# Altium schematic sheet SysUprTestUULed.SchDoc
size 594 x 420 mm; MainDevice: Плата индикации; Name: Плата индикации; PageSetup: Record=PageOptions|CenterHorizontal=True|CenterVertical=True|PrintScale=0.94|XCorrection=1.00|YCorrection=1.00|PrintKind=1|BorderSize=5000000|LeftOffset=0|BottomOffset=0|Orientation=1|PaperLength=1000|PaperWidth=1000|Scale=100|PaperSource=7|PrintQuality=-4|MediaType=1|DitherType=10|PaperKind=A4|PrintScaleMode=1; ApprovedBy: Кайбалдиев; CheckedBy: Савельев; DrawnBy: Соловьев; Engineer: Т.контр.; DocumentNumber: Э-917.03Э3; SheetNumber: 3; SheetTotal: 4; Title1str: Плата индикации; DocumentType1str: Схема электрическая; DocumentType2str: принципиальная; ImagePath: Э-917.03
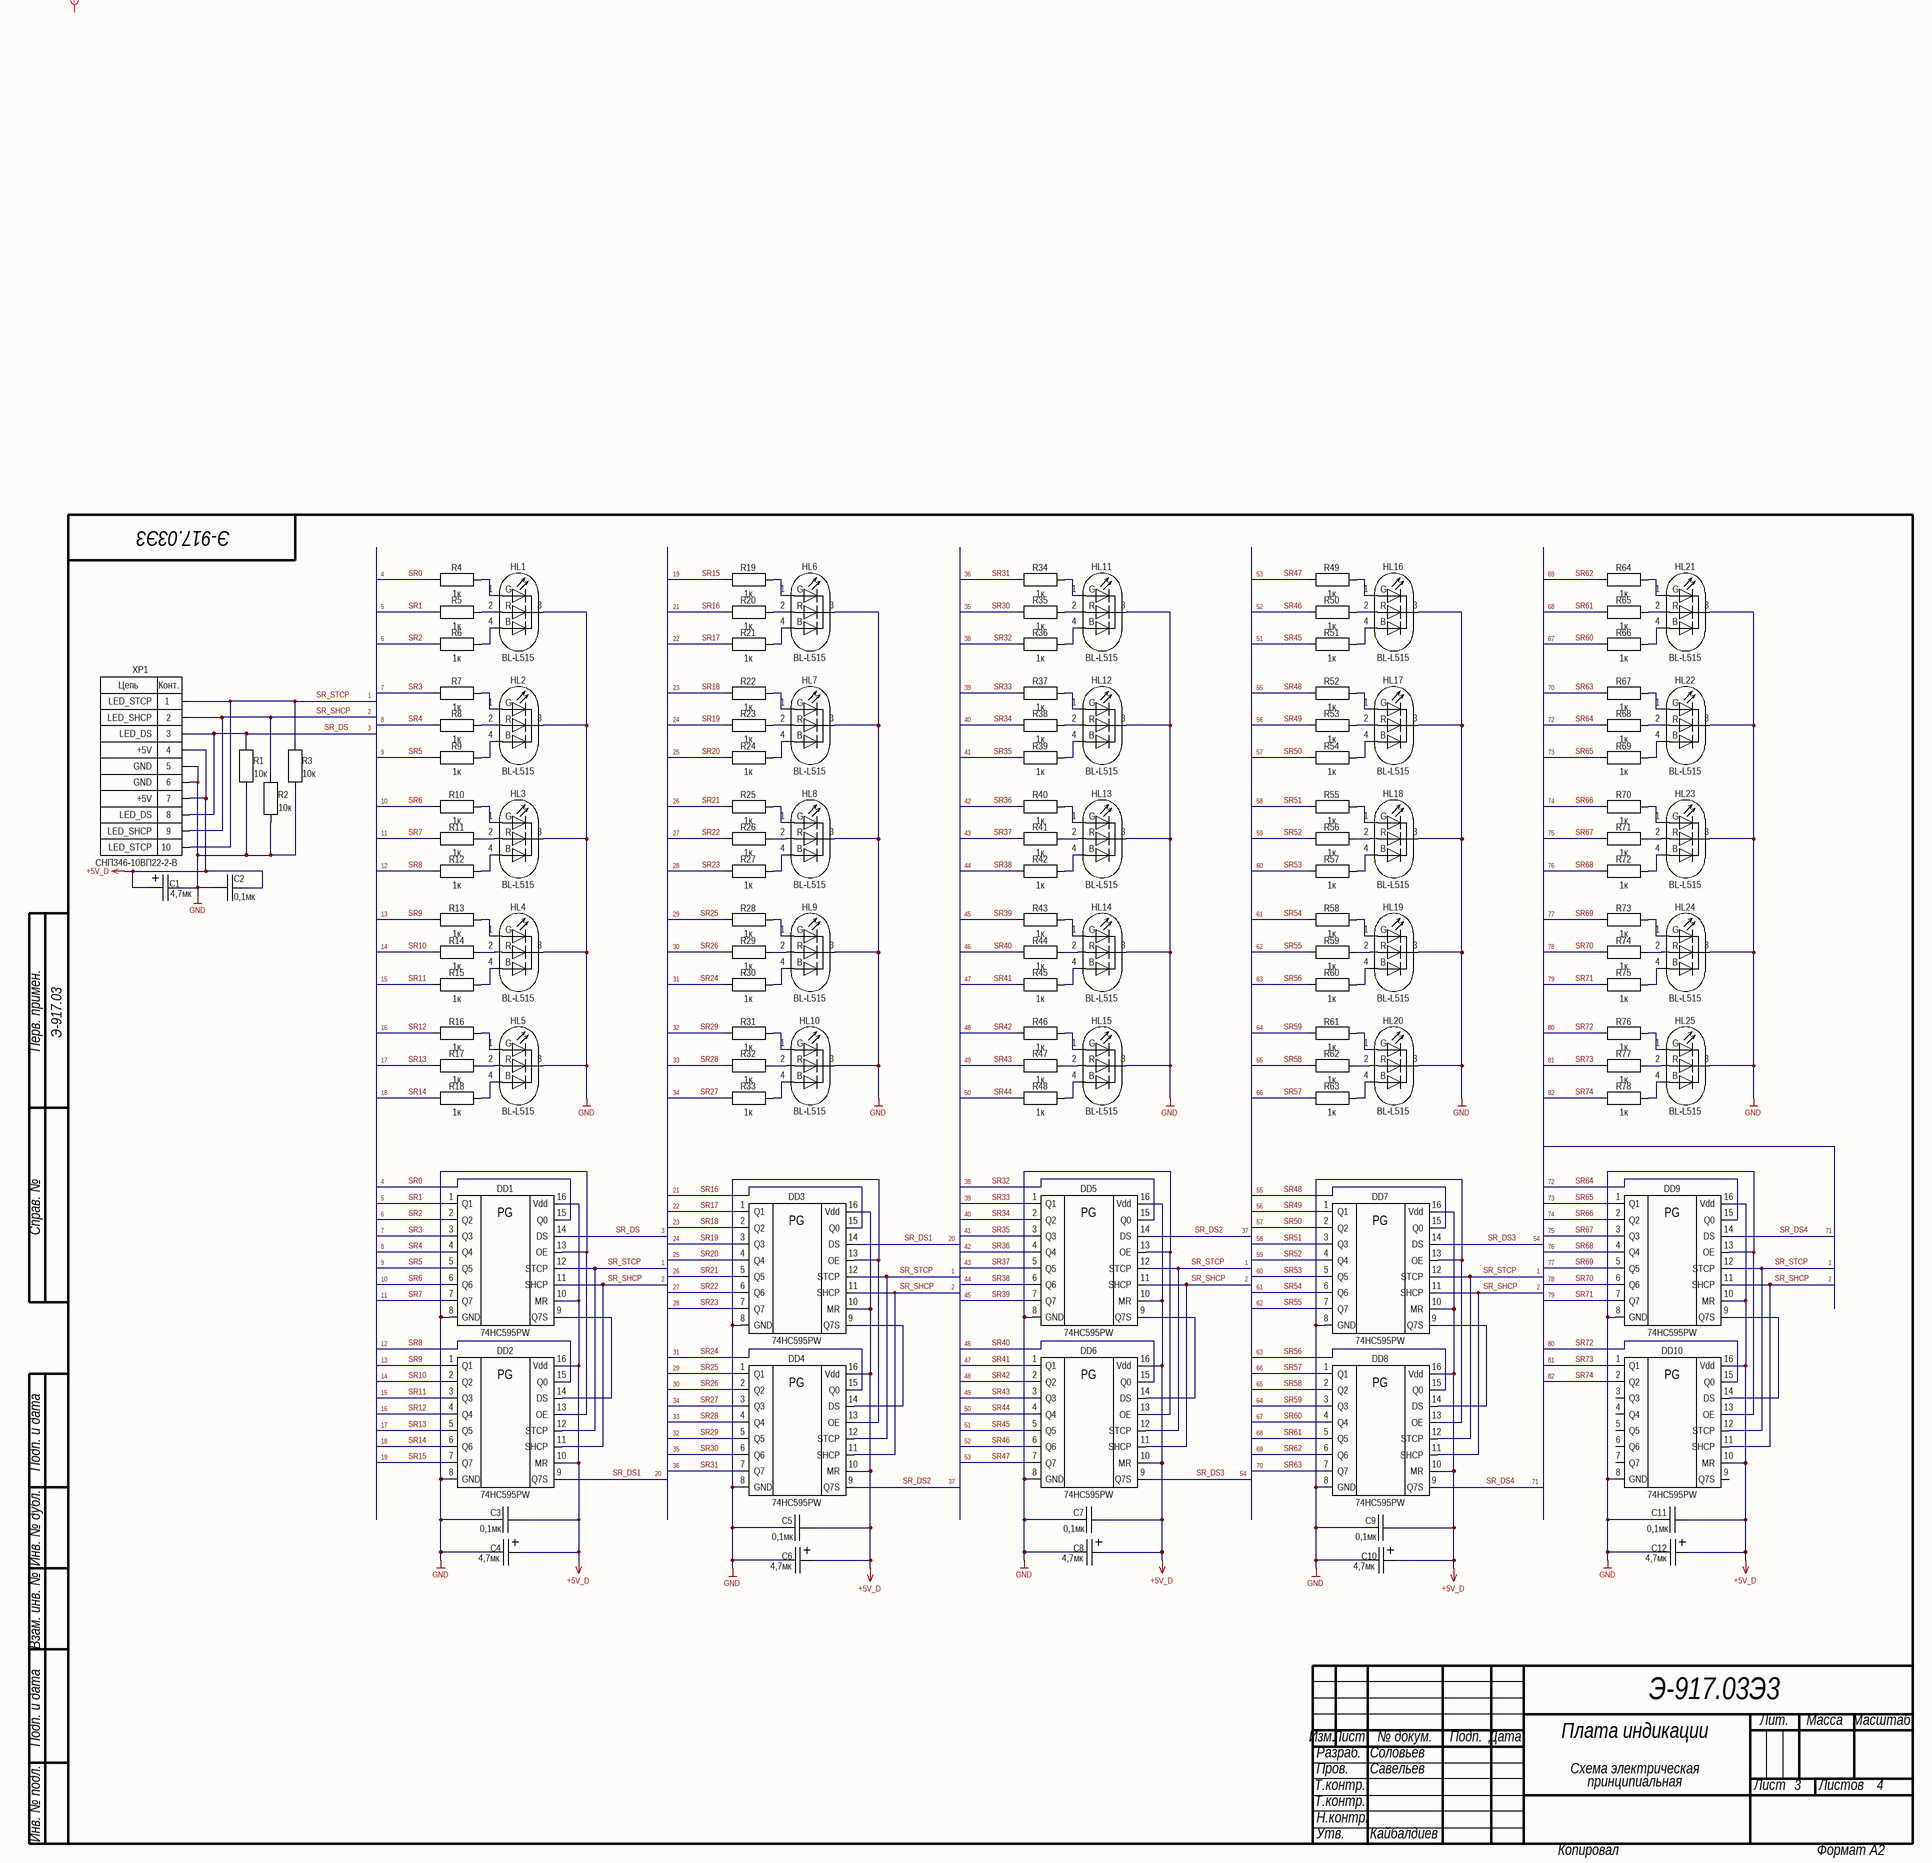
[diagram p0: SysUprTestUULed.SchDoc]

## Parts
C1  value 4,7мк  [CapCaseB]  (hidden comment: PolCap)
C2  value 0,1мк  [Cap0805]  (hidden comment: Capacitor)
C3  value 0,1мк  [Cap0805]  (hidden comment: Capacitor)
C4  value 4,7мк  [CapCaseB]  (hidden comment: PolCap)
C5  value 0,1мк  [Cap0805]  (hidden comment: Capacitor)
C6  value 4,7мк  [CapCaseB]  (hidden comment: PolCap)
C7  value 0,1мк  [Cap0805]  (hidden comment: Capacitor)
C8  value 4,7мк  [CapCaseB]  (hidden comment: PolCap)
C9  value 0,1мк  [Cap0805]  (hidden comment: Capacitor)
C10  value 4,7мк  [CapCaseB]  (hidden comment: PolCap)
C11  value 0,1мк  [Cap0805]  (hidden comment: Capacitor)
C12  value 4,7мк  [CapCaseB]  (hidden comment: PolCap)
DD1  74HC595  [TSSOP16]  (value not drawn)
DD2  74HC595  [TSSOP16]  (value not drawn)
DD3  74HC595  [TSSOP16]  (value not drawn)
DD4  74HC595  [TSSOP16]  (value not drawn)
DD5  74HC595  [TSSOP16]  (value not drawn)
DD6  74HC595  [TSSOP16]  (value not drawn)
DD7  74HC595  [TSSOP16]  (value not drawn)
DD8  74HC595  [TSSOP16]  (value not drawn)
DD9  74HC595  [TSSOP16]  (value not drawn)
DD10  74HC595  [TSSOP16]  (value not drawn)
HL1  LED-RGB_C  [BL-L515]  (value not drawn)
HL2  LED-RGB_C  [BL-L515]  (value not drawn)
HL3  LED-RGB_C  [BL-L515]  (value not drawn)
HL4  LED-RGB_C  [BL-L515]  (value not drawn)
HL5  LED-RGB_C  [BL-L515]  (value not drawn)
HL6  LED-RGB_C  [BL-L515]  (value not drawn)
HL7  LED-RGB_C  [BL-L515]  (value not drawn)
HL8  LED-RGB_C  [BL-L515]  (value not drawn)
HL9  LED-RGB_C  [BL-L515]  (value not drawn)
HL10  LED-RGB_C  [BL-L515]  (value not drawn)
HL11  LED-RGB_C  [BL-L515]  (value not drawn)
HL12  LED-RGB_C  [BL-L515]  (value not drawn)
HL13  LED-RGB_C  [BL-L515]  (value not drawn)
HL14  LED-RGB_C  [BL-L515]  (value not drawn)
HL15  LED-RGB_C  [BL-L515]  (value not drawn)
HL16  LED-RGB_C  [BL-L515]  (value not drawn)
HL17  LED-RGB_C  [BL-L515]  (value not drawn)
HL18  LED-RGB_C  [BL-L515]  (value not drawn)
HL19  LED-RGB_C  [BL-L515]  (value not drawn)
HL20  LED-RGB_C  [BL-L515]  (value not drawn)
HL21  LED-RGB_C  [BL-L515]  (value not drawn)
HL22  LED-RGB_C  [BL-L515]  (value not drawn)
HL23  LED-RGB_C  [BL-L515]  (value not drawn)
HL24  LED-RGB_C  [BL-L515]  (value not drawn)
HL25  LED-RGB_C  [BL-L515]  (value not drawn)
R1  value 10к  [Res0402]  (hidden comment: Resistor0062)
R2  value 10к  [Res0402]  (hidden comment: Resistor0062)
R3  value 10к  [Res0402]  (hidden comment: Resistor0062)
R4  value 1к  [Res0805]  (hidden comment: Resistor0125)
R5  value 1к  [Res0805]  (hidden comment: Resistor0125)
R6  value 1к  [Res0805]  (hidden comment: Resistor0125)
R7  value 1к  [Res0805]  (hidden comment: Resistor0125)
R8  value 1к  [Res0805]  (hidden comment: Resistor0125)
R9  value 1к  [Res0805]  (hidden comment: Resistor0125)
R10  value 1к  [Res0805]  (hidden comment: Resistor0125)
R11  value 1к  [Res0805]  (hidden comment: Resistor0125)
R12  value 1к  [Res0805]  (hidden comment: Resistor0125)
R13  value 1к  [Res0805]  (hidden comment: Resistor0125)
R14  value 1к  [Res0805]  (hidden comment: Resistor0125)
R15  value 1к  [Res0805]  (hidden comment: Resistor0125)
R16  value 1к  [Res0805]  (hidden comment: Resistor0125)
R17  value 1к  [Res0805]  (hidden comment: Resistor0125)
R18  value 1к  [Res0805]  (hidden comment: Resistor0125)
R19  value 1к  [Res0805]  (hidden comment: Resistor0125)
R20  value 1к  [Res0805]  (hidden comment: Resistor0125)
R21  value 1к  [Res0805]  (hidden comment: Resistor0125)
R22  value 1к  [Res0805]  (hidden comment: Resistor0125)
R23  value 1к  [Res0805]  (hidden comment: Resistor0125)
R24  value 1к  [Res0805]  (hidden comment: Resistor0125)
R25  value 1к  [Res0805]  (hidden comment: Resistor0125)
R26  value 1к  [Res0805]  (hidden comment: Resistor0125)
R27  value 1к  [Res0805]  (hidden comment: Resistor0125)
R28  value 1к  [Res0805]  (hidden comment: Resistor0125)
R29  value 1к  [Res0805]  (hidden comment: Resistor0125)
R30  value 1к  [Res0805]  (hidden comment: Resistor0125)
R31  value 1к  [Res0805]  (hidden comment: Resistor0125)
R32  value 1к  [Res0805]  (hidden comment: Resistor0125)
R33  value 1к  [Res0805]  (hidden comment: Resistor0125)
R34  value 1к  [Res0805]  (hidden comment: Resistor0125)
R35  value 1к  [Res0805]  (hidden comment: Resistor0125)
R36  value 1к  [Res0805]  (hidden comment: Resistor0125)
R37  value 1к  [Res0805]  (hidden comment: Resistor0125)
R38  value 1к  [Res0805]  (hidden comment: Resistor0125)
R39  value 1к  [Res0805]  (hidden comment: Resistor0125)
R40  value 1к  [Res0805]  (hidden comment: Resistor0125)
R41  value 1к  [Res0805]  (hidden comment: Resistor0125)
R42  value 1к  [Res0805]  (hidden comment: Resistor0125)
R43  value 1к  [Res0805]  (hidden comment: Resistor0125)
R44  value 1к  [Res0805]  (hidden comment: Resistor0125)
R45  value 1к  [Res0805]  (hidden comment: Resistor0125)
R46  value 1к  [Res0805]  (hidden comment: Resistor0125)
R47  value 1к  [Res0805]  (hidden comment: Resistor0125)
R48  value 1к  [Res0805]  (hidden comment: Resistor0125)
R49  value 1к  [Res0805]  (hidden comment: Resistor0125)
R50  value 1к  [Res0805]  (hidden comment: Resistor0125)
R51  value 1к  [Res0805]  (hidden comment: Resistor0125)
R52  value 1к  [Res0805]  (hidden comment: Resistor0125)
R53  value 1к  [Res0805]  (hidden comment: Resistor0125)
R54  value 1к  [Res0805]  (hidden comment: Resistor0125)
R55  value 1к  [Res0805]  (hidden comment: Resistor0125)
R56  value 1к  [Res0805]  (hidden comment: Resistor0125)
R57  value 1к  [Res0805]  (hidden comment: Resistor0125)
R58  value 1к  [Res0805]  (hidden comment: Resistor0125)
R59  value 1к  [Res0805]  (hidden comment: Resistor0125)
R60  value 1к  [Res0805]  (hidden comment: Resistor0125)
R61  value 1к  [Res0805]  (hidden comment: Resistor0125)
R62  value 1к  [Res0805]  (hidden comment: Resistor0125)
R63  value 1к  [Res0805]  (hidden comment: Resistor0125)
R64  value 1к  [Res0805]  (hidden comment: Resistor0125)
R65  value 1к  [Res0805]  (hidden comment: Resistor0125)
R66  value 1к  [Res0805]  (hidden comment: Resistor0125)
R67  value 1к  [Res0805]  (hidden comment: Resistor0125)
R68  value 1к  [Res0805]  (hidden comment: Resistor0125)
R69  value 1к  [Res0805]  (hidden comment: Resistor0125)
R70  value 1к  [Res0805]  (hidden comment: Resistor0125)
R71  value 1к  [Res0805]  (hidden comment: Resistor0125)
R72  value 1к  [Res0805]  (hidden comment: Resistor0125)
R73  value 1к  [Res0805]  (hidden comment: Resistor0125)
R74  value 1к  [Res0805]  (hidden comment: Resistor0125)
R75  value 1к  [Res0805]  (hidden comment: Resistor0125)
R76  value 1к  [Res0805]  (hidden comment: Resistor0125)
R77  value 1к  [Res0805]  (hidden comment: Resistor0125)
R78  value 1к  [Res0805]  (hidden comment: Resistor0125)
XP1  ConnectorP10  [PLD-10]  (value not drawn)

## Nets
+5V_D: C1.2 C2.1 C3.2 C4.2 C5.2 C6.2 C7.2 C8.2 C9.2 C10.2 C11.2 C12.2 DD1.10(MR) DD1.16(Vdd) DD2.10(MR) DD2.16(Vdd) DD3.10(MR) DD3.16(Vdd) DD4.10(MR) DD4.16(Vdd) DD5.10(MR) DD5.16(Vdd) DD6.10(MR) DD6.16(Vdd) DD7.10(MR) DD7.16(Vdd) DD8.10(MR) DD8.16(Vdd) DD9.10(MR) DD9.16(Vdd) DD10.10(MR) DD10.16(Vdd) XP1.4 XP1.7
GND: C1.1 C2.2 C3.1 C4.1 C5.1 C6.1 C7.1 C8.1 C9.1 C10.1 C11.1 C12.1 DD1.8(GND) DD1.13(OE) DD2.8(GND) DD2.13(OE) DD3.8(GND) DD3.13(OE) DD4.8(GND) DD4.13(OE) DD5.8(GND) DD5.13(OE) DD6.8(GND) DD6.13(OE) DD7.8(GND) DD7.13(OE) DD8.8(GND) DD8.13(OE) DD9.8(GND) DD9.13(OE) DD10.8(GND) DD10.13(OE) HL1.3(A) HL2.3(A) HL3.3(A) HL4.3(A) HL5.3(A) HL6.3(A) HL7.3(A) HL8.3(A) HL9.3(A) HL10.3(A) HL11.3(A) HL12.3(A) HL13.3(A) HL14.3(A) HL15.3(A) HL16.3(A) HL17.3(A) HL18.3(A) HL19.3(A) HL20.3(A) HL21.3(A) HL22.3(A) HL23.3(A) HL24.3(A) HL25.3(A) R1.1 R2.1 R3.1 XP1.5 XP1.6
SR0: DD1.15(Q0) R4.2
SR1: DD1.1(Q1) R5.2
SR2: DD1.2(Q2) R6.2
SR3: DD1.3(Q3) R7.2
SR4: DD1.4(Q4) R8.2
SR5: DD1.5(Q5) R9.2
SR6: DD1.6(Q6) R10.2
SR7: DD1.7(Q7) R11.2
SR8: DD2.15(Q0) R12.2
SR9: DD2.1(Q1) R13.2
SR10: DD2.2(Q2) R14.2
SR11: DD2.3(Q3) R15.2
SR12: DD2.4(Q4) R16.2
SR13: DD2.5(Q5) R17.2
SR14: DD2.6(Q6) R18.2
SR15: DD2.7(Q7) R19.2
SR16: DD3.15(Q0) R20.2
SR17: DD3.1(Q1) R21.2
SR18: DD3.2(Q2) R22.2
SR19: DD3.3(Q3) R23.2
SR20: DD3.4(Q4) R24.2
SR21: DD3.5(Q5) R25.2
SR22: DD3.6(Q6) R26.2
SR23: DD3.7(Q7) R27.2
SR24: DD4.15(Q0) R30.2
SR25: DD4.1(Q1) R28.2
SR26: DD4.2(Q2) R29.2
SR27: DD4.3(Q3) R33.2
SR28: DD4.4(Q4) R32.2
SR29: DD4.5(Q5) R31.2
SR30: DD4.6(Q6) R35.2
SR31: DD4.7(Q7) R34.2
SR32: DD5.15(Q0) R36.2
SR33: DD5.1(Q1) R37.2
SR34: DD5.2(Q2) R38.2
SR35: DD5.3(Q3) R39.2
SR36: DD5.4(Q4) R40.2
SR37: DD5.5(Q5) R41.2
SR38: DD5.6(Q6) R42.2
SR39: DD5.7(Q7) R43.2
SR40: DD6.15(Q0) R44.2
SR41: DD6.1(Q1) R45.2
SR42: DD6.2(Q2) R46.2
SR43: DD6.3(Q3) R47.2
SR44: DD6.4(Q4) R48.2
SR45: DD6.5(Q5) R51.2
SR46: DD6.6(Q6) R50.2
SR47: DD6.7(Q7) R49.2
SR48: DD7.15(Q0) R52.2
SR49: DD7.1(Q1) R53.2
SR50: DD7.2(Q2) R54.2
SR51: DD7.3(Q3) R55.2
SR52: DD7.4(Q4) R56.2
SR53: DD7.5(Q5) R57.2
SR54: DD7.6(Q6) R58.2
SR55: DD7.7(Q7) R59.2
SR56: DD8.15(Q0) R60.2
SR57: DD8.1(Q1) R63.2
SR58: DD8.2(Q2) R62.2
SR59: DD8.3(Q3) R61.2
SR60: DD8.4(Q4) R66.2
SR61: DD8.5(Q5) R65.2
SR62: DD8.6(Q6) R64.2
SR63: DD8.7(Q7) R67.2
SR64: DD9.15(Q0) R68.2
SR65: DD9.1(Q1) R69.2
SR66: DD9.2(Q2) R70.2
SR67: DD9.3(Q3) R71.2
SR68: DD9.4(Q4) R72.2
SR69: DD9.5(Q5) R73.2
SR70: DD9.6(Q6) R74.2
SR71: DD9.7(Q7) R75.2
SR72: DD10.15(Q0) R76.2
SR73: DD10.1(Q1) R77.2
SR74: DD10.2(Q2) R78.2
SR_DS: DD1.14(DS) R1.2 XP1.3 XP1.8
SR_DS1: DD2.9(Q7S) DD3.14(DS)
SR_DS2: DD4.9(Q7S) DD5.14(DS)
SR_DS3: DD6.9(Q7S) DD7.14(DS)
SR_DS4: DD8.9(Q7S) DD9.14(DS)
SR_SHCP: DD1.11(SHCP) DD2.11(SHCP) DD3.11(SHCP) DD4.11(SHCP) DD5.11(SHCP) DD6.11(SHCP) DD7.11(SHCP) DD8.11(SHCP) DD9.11(SHCP) DD10.11(SHCP) R2.2 XP1.2 XP1.9
SR_STCP: DD1.12(STCP) DD2.12(STCP) DD3.12(STCP) DD4.12(STCP) DD5.12(STCP) DD6.12(STCP) DD7.12(STCP) DD8.12(STCP) DD9.12(STCP) DD10.12(STCP) R3.2 XP1.1 XP1.10
NetDD1_9: DD1.9(Q7S) DD2.14(DS)
NetDD3_9: DD3.9(Q7S) DD4.14(DS)
NetDD5_9: DD5.9(Q7S) DD6.14(DS)
NetDD7_9: DD7.9(Q7S) DD8.14(DS)
NetDD9_9: DD9.9(Q7S) DD10.14(DS)
NetHL1_1: HL1.1(G) R4.1
NetHL1_2: HL1.2(B) R5.1
NetHL1_4: HL1.4(R) R6.1
NetHL2_1: HL2.1(G) R7.1
NetHL2_2: HL2.2(B) R8.1
NetHL2_4: HL2.4(R) R9.1
NetHL3_1: HL3.1(G) R10.1
NetHL3_2: HL3.2(B) R11.1
NetHL3_4: HL3.4(R) R12.1
NetHL4_1: HL4.1(G) R13.1
NetHL4_2: HL4.2(B) R14.1
NetHL4_4: HL4.4(R) R15.1
NetHL5_1: HL5.1(G) R16.1
NetHL5_2: HL5.2(B) R17.1
NetHL5_4: HL5.4(R) R18.1
NetHL6_1: HL6.1(G) R19.1
NetHL6_2: HL6.2(B) R20.1
NetHL6_4: HL6.4(R) R21.1
NetHL7_1: HL7.1(G) R22.1
NetHL7_2: HL7.2(B) R23.1
NetHL7_4: HL7.4(R) R24.1
NetHL8_1: HL8.1(G) R25.1
NetHL8_2: HL8.2(B) R26.1
NetHL8_4: HL8.4(R) R27.1
NetHL9_1: HL9.1(G) R28.1
NetHL9_2: HL9.2(B) R29.1
NetHL9_4: HL9.4(R) R30.1
NetHL10_1: HL10.1(G) R31.1
NetHL10_2: HL10.2(B) R32.1
NetHL10_4: HL10.4(R) R33.1
NetHL11_1: HL11.1(G) R34.1
NetHL11_2: HL11.2(B) R35.1
NetHL11_4: HL11.4(R) R36.1
NetHL12_1: HL12.1(G) R37.1
NetHL12_2: HL12.2(B) R38.1
NetHL12_4: HL12.4(R) R39.1
NetHL13_1: HL13.1(G) R40.1
NetHL13_2: HL13.2(B) R41.1
NetHL13_4: HL13.4(R) R42.1
NetHL14_1: HL14.1(G) R43.1
NetHL14_2: HL14.2(B) R44.1
NetHL14_4: HL14.4(R) R45.1
NetHL15_1: HL15.1(G) R46.1
NetHL15_2: HL15.2(B) R47.1
NetHL15_4: HL15.4(R) R48.1
NetHL16_1: HL16.1(G) R49.1
NetHL16_2: HL16.2(B) R50.1
NetHL16_4: HL16.4(R) R51.1
NetHL17_1: HL17.1(G) R52.1
NetHL17_2: HL17.2(B) R53.1
NetHL17_4: HL17.4(R) R54.1
NetHL18_1: HL18.1(G) R55.1
NetHL18_2: HL18.2(B) R56.1
NetHL18_4: HL18.4(R) R57.1
NetHL19_1: HL19.1(G) R58.1
NetHL19_2: HL19.2(B) R59.1
NetHL19_4: HL19.4(R) R60.1
NetHL20_1: HL20.1(G) R61.1
NetHL20_2: HL20.2(B) R62.1
NetHL20_4: HL20.4(R) R63.1
NetHL21_1: HL21.1(G) R64.1
NetHL21_2: HL21.2(B) R65.1
NetHL21_4: HL21.4(R) R66.1
NetHL22_1: HL22.1(G) R67.1
NetHL22_2: HL22.2(B) R68.1
NetHL22_4: HL22.4(R) R69.1
NetHL23_1: HL23.1(G) R70.1
NetHL23_2: HL23.2(B) R71.1
NetHL23_4: HL23.4(R) R72.1
NetHL24_1: HL24.1(G) R73.1
NetHL24_2: HL24.2(B) R74.1
NetHL24_4: HL24.4(R) R75.1
NetHL25_1: HL25.1(G) R76.1
NetHL25_2: HL25.2(B) R77.1
NetHL25_4: HL25.4(R) R78.1

Not connected (* = marked no-connect by the designer): DD10 3(Q3) 4(Q4) 5(Q5) 6(Q6) 7(Q7) 9(Q7S)

## Layout directives
mark named Info: (no net found under the mark)

## Notes on the sheet
- 4
- (near HL1) "ALM1"
- 19
- (near HL6) "ALM6"
- 36
- (near HL11) "ALM11"
- 53
- (near HL16) "ALM16"
- 69
- (near HL21) "ALM21"
- 5
- 6
- 21
- 22
- 35
- 38
- 51
- 52
- 67
- 68
- 1
- 2
- 7
- 8
- (near HL2) "ALM2"
- 23
- 24
- (near HL7) "ALM7"
- 39
- 40
- (near HL12) "ALM12"
- 55
- 56
- (near HL17) "ALM17"
- 70
- 72
- (near HL22) "ALM22"
- 3
- 9
- 25
- 41
- 57
- 73
- 10
- (near HL3) "ALM3"
- 26
- (near HL8) "ALM8"
- 42
- (near HL13) "ALM13"
- 58
- (near HL18) "ALM18"
- 74
- (near HL23) "ALM23"
- 11
- 27
- 43
- 59
- 75
- 12
- 28
- 44
- 60
- 76
- 13
- (near HL4) "ALM4"
- 29
- (near HL9) "ALM9"
- 45
- (near HL14) "ALM14"
- 61
- (near HL19) "ALM19"
- 77
- (near HL24) "ALM24"
- 14
- 30
- 46
- 62
- 78
- 15
- 31
- 47
- 63
- 79
- 16
- (near HL5) "ALM5"
- 32
- (near HL10) "ALM10"
- 48
- (near HL15) "ALM15"
- 64
- (near HL20) "ALM20"
- 80
- (near HL25) "ALM25"
- 17
- 18
- 33
- 34
- 49
- 50
- 65
- 66
- 81
- 82
- 20
- 37
- 54
- 71
- Перв. примен.
- Справ. №
- Подп. и дата
- Инв. № дубл.
- Взам. инв. №
- Изм.
- Лист
- № докум.
- Подп.
- Дата
- Лит.
- Масса
- Масштаб
- Т.контр.
- Пров.
- Разраб.
- Листов
- Инв. № подл.
- Н.контр.
- Утв.
- Копировал
- Формат А2
- (in symbol 40) PG
- (in symbol 45) Цепь; Конт.

## Library data of the parts
C1 C4 C6 C8 C10 C12 = 2164: PartNumber: К53-56А-16 В-4,7 мкФ±20 %; Manufacturer: АО «НИИ ГИРИКОНД»; ManufacturerTU: АЖЯР.673546.001ТУ; Alternative: Case B 4,7 мкФ, 16 В, ±20 %; Alternative2: К53-56А-16 В-4,7 мкФ±20 % В АДПК.673546.005ТУ; Name: К53-56А; Group: Конденсаторы; ViewControl: В, 10%; SolderName: K53-56A-16V-4.7mkF; X_SORT_1: 100; X_SORT_2: 200; X_SORT_3: 3; SolderTemperature: 265; TemperatureRange: от минус 60 до 125; CardKRR: 67; VoltageLimit: 16; Key: 2164; MilitaryControl: ВП; MountType: ПМ; Modify: 13.03.2019; Package: K2 (Case B); ComponentLink1Description: К53-56А; ComponentLink1URL: \\192.168.0.253\U_Base\PDF\C\K53-56.pdf; HelpURL: \\192.168.0.253\U_Base\PDF\C\K53-56.pdf; DataSheet: #\\192.168.0.253\U_Base\PDF\C\К53-56А.pdf#
C2 C3 C5 C7 C9 C11 = 2161: PartNumber: К10-84в-2012М-50 В-Н90-0,1 мкФ+80 %-20 %-N-A; Manufacturer: ОАО «ВЗРД Монолит»; ManufacturerTU: ФЦТА.673516.016ТУ; Alternative: 0805 0,1 мкФ, 50 В, ±10 %; Name: К10-84в; Group: Конденсаторы; ViewControl: В, 10%; SolderName: K10-84v-2012M-50V-N90-0,1mkF; X_SORT_1: 100; X_SORT_2: 200; X_SORT_3: 3; SolderTemperature: 175; TemperatureRange: от минус 60 до 85; CardKRR: 67; Key: 2161; VoltageLimit: 50; MilitaryControl: ВП; MountType: ПМ; Modify: 13.03.2019; Package: 0805 (2012); ComponentLink1Description: К10-84; ComponentLink1URL: \\192.168.0.253\U_Base\PDF\C\K10-84.pdf; HelpURL: \\192.168.0.253\U_Base\PDF\C\K10-84.pdf; DataSheet: #\\192.168.0.253\U_Base\PDF\C\K10-84.pdf#
DD1-DD10 = 40: Notice: ONSemiconductor; Group: Микросхемы; CardKRR: 65; Name: 74НС595PW; ViewControl: В, 100%; key: 40; SolderName: 74NS595PW; TemperatureRange: от минус 40 до 125; X_SORT_1: 200; X_SORT_2: 401; X_SORT_3: 3; Manufacturer: ONSemiconductor; HelpURL: \\192.168.0.101\U_Base\PDF\D\74HC595PW.pdf; MilitaryControl: ОТК; MountType: ПМ; Modify: 14.03.2019; PartNumber: 74НС595PW; Package: TSSOP16; ComponentLink1URL: \\192.168.0.101\U_Base\PDF\D\74HC595PW.pdf; DataSheet: #\\192.168.0.101\U_Base\PDF\D\74HC595PW.pdf#
HL1-HL25 = 90: Светодиод RGB с общим анодом BL-L515RGBW-CA; PartNumber: Светодиод BL-L515RGBW-CС; Notice: Betlux Electronics; Group: Светодиоды; ViewControl: В, 10%; key: 90; X_SORT_1: 500; X_SORT_2: 301; X_SORT_3: 3; Name: BL-L515; Modify: 14.03.2019; Manufacturer: Betlux Electronics; MilitaryControl: ОТК; MountType: РМ; SolderName: BL-L515; Package: 6mm; ComponentLink1Description: BL-L515; ComponentLink1URL: \\192.168.0.101\U_Base\PDF\V\BetLux Electronics.pdf; HelpURL: \\192.168.0.101\U_Base\PDF\V\BetLux Electronics.pdf; DataSheet: #\\192.168.0.101\U_Base\PDF\V\BetLux Electronics.pdf#
R1-R3 = 2905: PartNumber: Р1-8В-0,063-10 кОм±5 %-Т-А; Manufacturer: АО «НПО «Эркон»; ManufacturerTU: ОЖ0.467.164ТУ; Alternative: 0402 10 кОм, 0,062 Вт, ±5 %; Alternative2: Р1-8В-0,062-10 кОм±5 %-Т-А ОЖ0.467.164ТУ; Name: Р1-8В; Group: Резисторы; ViewControl: В, 10%; SolderName: R1-8B-0.063-10kOm; Mark: 103; X_SORT_1: 400; X_SORT_2: 100; X_SORT_3: 3; Mass: 0,0007; SolderTemperature: 255; TemperatureRange: от минус 65 до 155; CardKRR: 68; VoltageLimit: 50; PowerLimit: 0,063; key: 2905; Modify: 28.06.2019; MilitaryControl: ВП; MountType: ПМ; Package: 0402 (1005); ComponentLink1Description: Р1-8В; ComponentLink1URL: \\192.168.0.253\U_Base\PDF\R\Р1-8В.pdf; HelpURL: \\192.168.0.253\U_Base\PDF\R\Р1-8В.pdf; DataSheet: #\\192.168.0.253\U_Base\PDF\R\Р1-8В.pdf#
R4-R78 = 2957: Manufacturer: АО «НПО «Эркон»; ManufacturerTU: ОЖ0.467.164ТУ; PartNumber: Р1-8В-0,125-1 кОм±5 %-Т-А; Alternative: 0805 1 кОм, 0,125 Вт, ±5 %; Alternative2: Р1-8В-0,125-1 кОм±5 %-Т-А ОЖ0.467.164ТУ; Name: Р1-8В; Group: Резисторы; ViewControl: В, 10%; key: 2957; SolderName: R1-8B-0.125-1kOm; Mark: 102; Mass: 0,006; SolderTemperature: 255; TemperatureRange: от минус 65 до 155; CardKRR: 68; VoltageLimit: 150; PowerLimit: 0,125; X_SORT_1: 400; X_SORT_2: 100; X_SORT_3: 3; Modify: 28.06.2019; MilitaryControl: ВП; MountType: ПМ; Package: 0805 (2012); ComponentLink1Description: Р1-8В; ComponentLink1URL: \\192.168.0.101\U_Base\PDF\R\Р1-8В.pdf; HelpURL: \\192.168.0.101\U_Base\PDF\R\Р1-8В.pdf; DataSheet: #\\192.168.0.101\U_Base\PDF\R\Р1-8В.pdf#
XP1 = 45: Manufacturer: АО «Карачевский завод Электродеталь»; ManufacturerTU: РЮМК.430420.011ТУ; PartNumber: Вилка СНП346-10ВП22-2-В; Conn11Name: 11; Conn12Name: 12; Conn13Name: 13; Conn14Name: 14; Conn15Name: 15; Conn16Name: 16; Conn17Name: 17; Conn18Name: 18; Conn19Name: 19; Conn20Name: 20; Conn21Name: 21; Conn22Name: 22; Conn23Name: 23; Conn24Name: 24; Conn25Name: 25; Conn26Name: 26; Conn27Name: 27; Conn28Name: 28; Conn29Name: 29; Conn30Name: 30; Conn31Name: 31; Conn32Name: 32; Conn33Name: 33; Conn34Name: 34; Conn35Name: 35; Conn36Name: 36; Conn37Name: 37; Conn38Name: 38; Conn39Name: 39; Conn40Name: 40; Conn01Name: LED_STCP; Conn02Name: LED_SHCP; Conn03Name: LED_DS; Conn04Name: +5V; Conn05Name: GND; Alternative2: СНП346-10ВП22-2 РЮМК.430420.019ТУ; Name: СНП346-10ВП22-2-В; Value: 10; Group: Соединители; ViewControl: В, 10%; key: 45; SolderName: SNP346-10VP22-2; Mass: 0,0006; TemperatureRange: от минус 60 до 85; CardKRR: 75; VoltageLimit: 250; CurrentLimit: 1; X_SORT_1: 700; X_SORT_2: 600; X_SORT_3: 3; Conn06Name: GND; Conn07Name: +5V; Conn08Name: LED_DS; Conn09Name: LED_SHCP; Conn10Name: LED_STCP; Alternative: PLD-10; MilitaryControl: ВП; MountType: РМ; Modify: 19.09.2018; Package: PLD; ComponentLink1Description: СНП346; ComponentLink1URL: \\192.168.0.101\U_Base\PDF\X\СНП346.pdf; HelpURL: \\192.168.0.101\U_Base\PDF\X\СНП346.pdf; DataSheet: #\\192.168.0.101\U_Base\PDF\X\СНП346.pdf#; PowerLimit: 250